# EAGLE design shieldrasp2 (EAGLE 9.5.1)
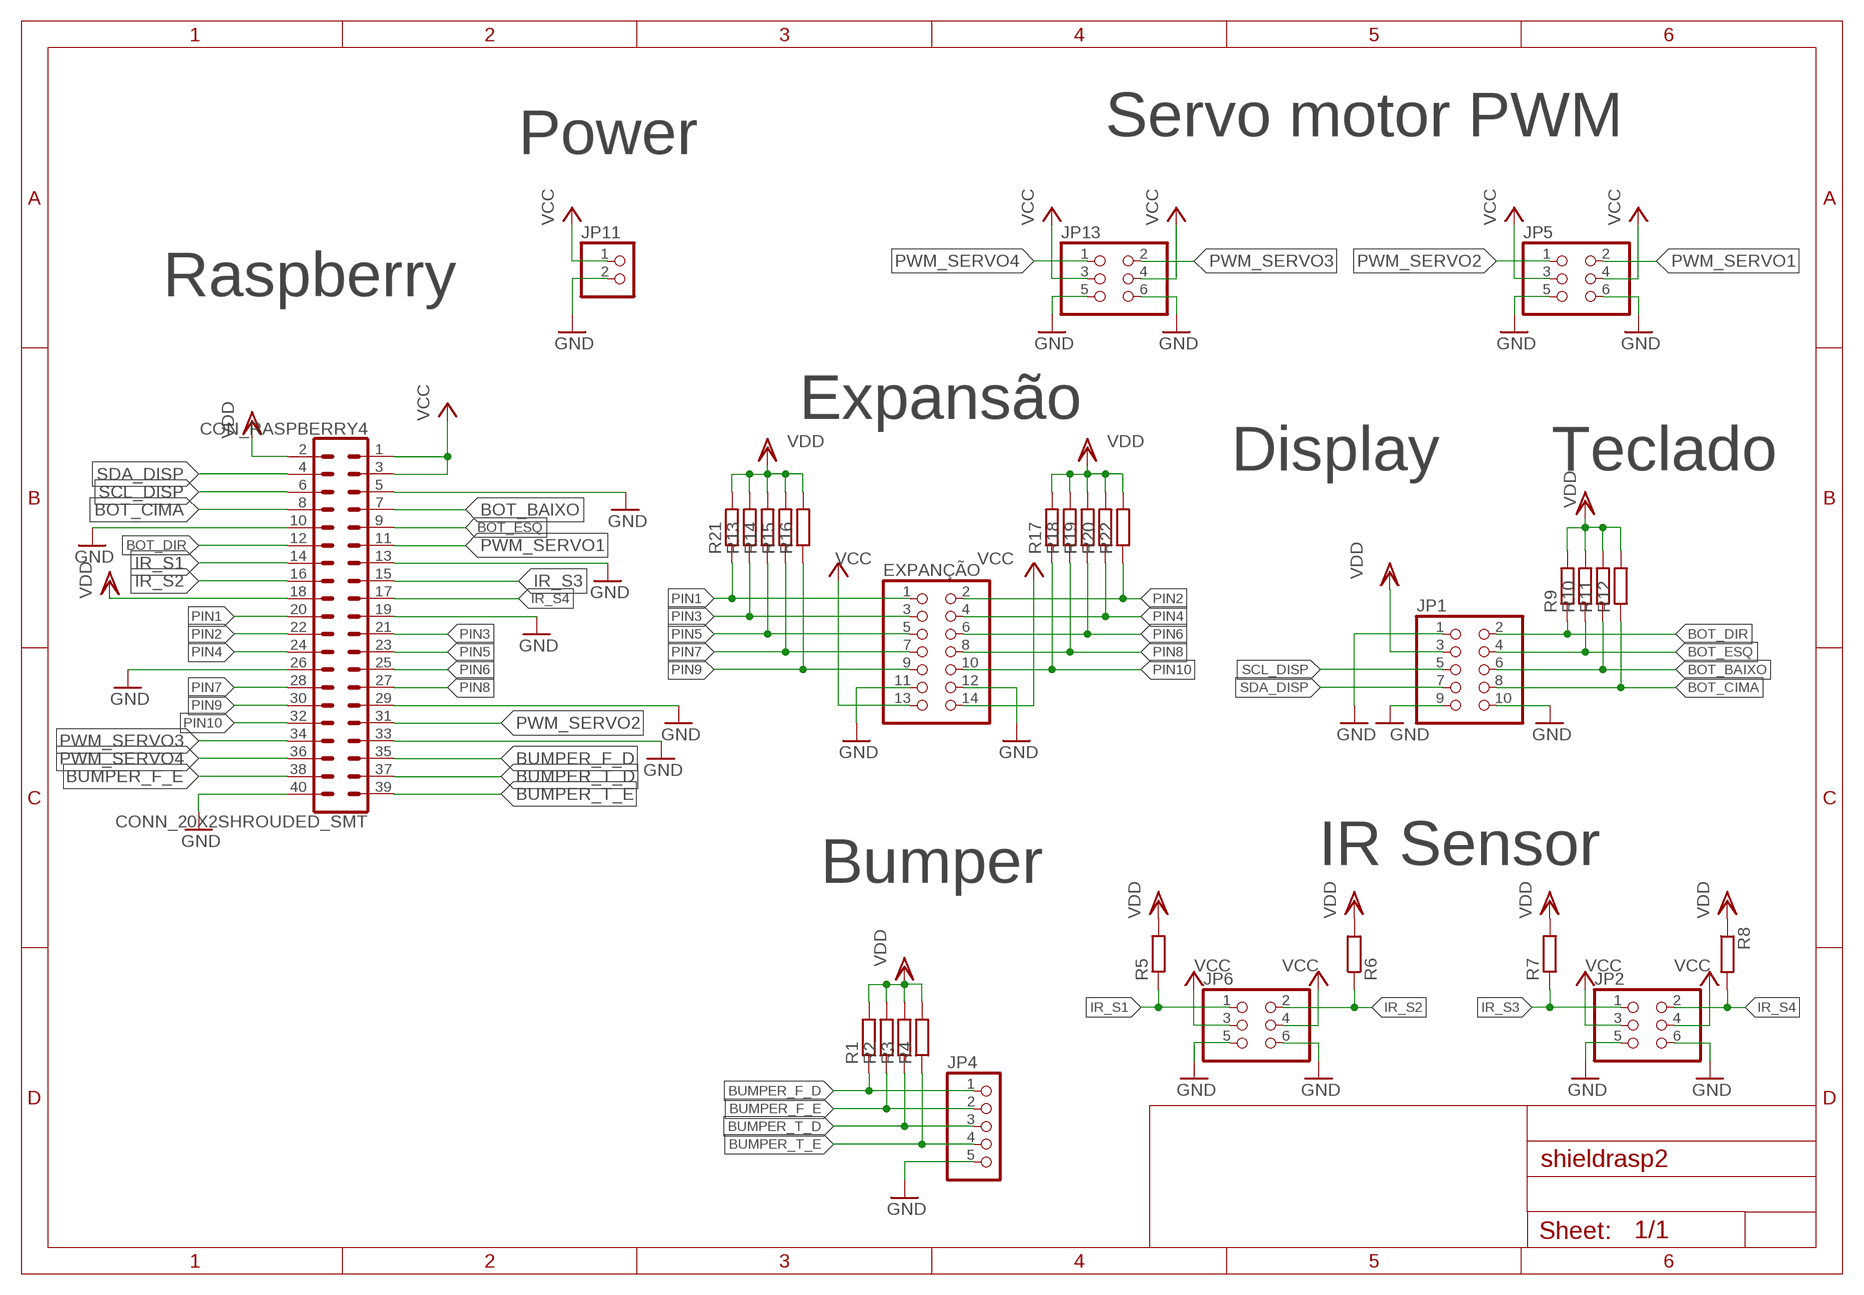
[diagram p0: schematic, sheet 1]

## Parts
CON_RASPBERRY4  CONN_20X2SHROUDED_SMT  [2X20_SHROUDED_SMT]
EXPANÇÃO  PINHD-2X7  [2X07]
JP1  PINHD-2X5/90  [2X05/90]
JP2  PINHD-2X3/90  [2X03/90]
JP4  PINHD-1X5/90  [1X05/90]
JP5  PINHD-2X3/90  [2X03/90]
JP6  PINHD-2X3/90  [2X03/90]
JP11  PINHD-1X2/90  [1X02/90]
JP13  PINHD-2X3/90  [2X03/90]
R1  R-EU_M0805  [M0805]
R2  R-EU_M0805  [M0805]
R3  R-EU_M0805  [M0805]
R4  R-EU_M0805  [M0805]
R5  R-EU_M0805  [M0805]
R6  R-EU_M0805  [M0805]
R7  R-EU_M0805  [M0805]
R8  R-EU_M0805  [M0805]
R9  R-EU_M0805  [M0805]
R10  R-EU_M0805  [M0805]
R11  R-EU_M0805  [M0805]
R12  R-EU_M0805  [M0805]
R13  R-EU_M0805  [M0805]
R14  R-EU_M0805  [M0805]
R15  R-EU_M0805  [M0805]
R16  R-EU_M0805  [M0805]
R17  R-EU_M0805  [M0805]
R18  R-EU_M0805  [M0805]
R19  R-EU_M0805  [M0805]
R20  R-EU_M0805  [M0805]
R21  R-EU_M0805  [M0805]
R22  R-EU_M0805  [M0805]

## Nets
BOT_BAIXO: CON_RASPBERRY4.7 JP1.6 R11.1
BOT_CIMA: CON_RASPBERRY4.8 JP1.8 R12.1
BOT_DIR: CON_RASPBERRY4.12 JP1.2 R9.1
BOT_ESQ: CON_RASPBERRY4.9 JP1.4 R10.1
BUMPER_F_D: CON_RASPBERRY4.35 JP4.1 R1.1
BUMPER_F_E: CON_RASPBERRY4.38 JP4.2 R2.1
BUMPER_T_D: CON_RASPBERRY4.37 JP4.3 R3.1
BUMPER_T_E: CON_RASPBERRY4.39 JP4.4 R4.1
GND: CON_RASPBERRY4.5 CON_RASPBERRY4.10 CON_RASPBERRY4.13 CON_RASPBERRY4.19 CON_RASPBERRY4.26 CON_RASPBERRY4.29 CON_RASPBERRY4.33 CON_RASPBERRY4.40 EXPANÇÃO.11 EXPANÇÃO.12 JP1.1 JP1.9 JP1.10 JP2.5 JP2.6 JP4.5 JP5.5 JP5.6 JP6.5 JP6.6 JP11.2 JP13.5 JP13.6
IR_S1: CON_RASPBERRY4.14 JP6.1 R5.1
IR_S2: CON_RASPBERRY4.16 JP6.2 R6.1
IR_S3: CON_RASPBERRY4.15 JP2.1 R7.1
IR_S4: CON_RASPBERRY4.17 JP2.2 R8.2
PIN1: CON_RASPBERRY4.20 EXPANÇÃO.1 R21.1
PIN2: CON_RASPBERRY4.22 EXPANÇÃO.2 R22.1
PIN3: CON_RASPBERRY4.21 EXPANÇÃO.3 R13.1
PIN4: CON_RASPBERRY4.24 EXPANÇÃO.4 R20.1
PIN5: CON_RASPBERRY4.23 EXPANÇÃO.5 R14.1
PIN6: CON_RASPBERRY4.25 EXPANÇÃO.6 R19.1
PIN7: CON_RASPBERRY4.28 EXPANÇÃO.7 R15.1
PIN8: CON_RASPBERRY4.27 EXPANÇÃO.8 R18.1
PIN9: CON_RASPBERRY4.30 EXPANÇÃO.9 R16.1
PIN10: CON_RASPBERRY4.32 EXPANÇÃO.10 R17.1
PWM_SERVO1: CON_RASPBERRY4.11 JP5.2
PWM_SERVO2: CON_RASPBERRY4.31 JP5.1
PWM_SERVO3: CON_RASPBERRY4.34 JP13.2
PWM_SERVO4: CON_RASPBERRY4.36 JP13.1
SCL_DISP: CON_RASPBERRY4.6 JP1.5
SDA_DISP: CON_RASPBERRY4.4 JP1.7
VCC: CON_RASPBERRY4.1 CON_RASPBERRY4.3 EXPANÇÃO.13 EXPANÇÃO.14 JP2.3 JP2.4 JP5.3 JP5.4 JP6.3 JP6.4 JP11.1 JP13.3 JP13.4
VDD [vcc]: CON_RASPBERRY4.2 CON_RASPBERRY4.18 JP1.3 R1.2 R2.2 R3.2 R4.2 R5.2 R6.2 R7.2 R8.1 R9.2 R10.2 R11.2 R12.2 R13.2 R14.2 R15.2 R16.2 R17.2 R18.2 R19.2 R20.2 R21.2 R22.2

## Notes on the sheet
- Power | Servo motor PWM
- Raspberry
- Expansão
- Display | Teclado
- Bumper | IR Sensor

## Library data of the parts
CON_RASPBERRY4 = SparkFun-Connectors:CONN_20X2: Multi connection point. Often used as Generic Header-pin footprint for 0.1 inch spaced/style header connections On any of the 0.1 inch spaced packages, you can populate with these: Break Away Headers - Straight <https://www.sparkfun.com/products/116> (PRT-00116) Break Away Male Headers - Right Angle <https://www.sparkfun.com/products/553> (PRT-00553) Female Headers <https://www.sparkfun.com/products/115> (PRT-00115) Break Away Headers - Machine Pin <https://www.sparkfun.com/products/117> (PRT-00117) Break Away Female Headers - Swiss Machine Pin <https://www.sparkfun.com/products/743> (PRT-00743); PROD_ID: CONN-13143
EXPANÇÃO = pinhead:PINHD-2X7: PIN HEADER
JP1 = pinhead:PINHD-2X5: PIN HEADER
JP2 JP5 JP6 JP13 = pinhead:PINHD-2X3: PIN HEADER
JP4 = pinhead:PINHD-1X5: PIN HEADER
JP11 = pinhead:PINHD-1X2: PIN HEADER
R1-R22 = rcl:R-EU_: RESISTOR, European symbol; SPICEPREFIX: R

## Net classes
1 vcc: width 0.508 mm

## Board
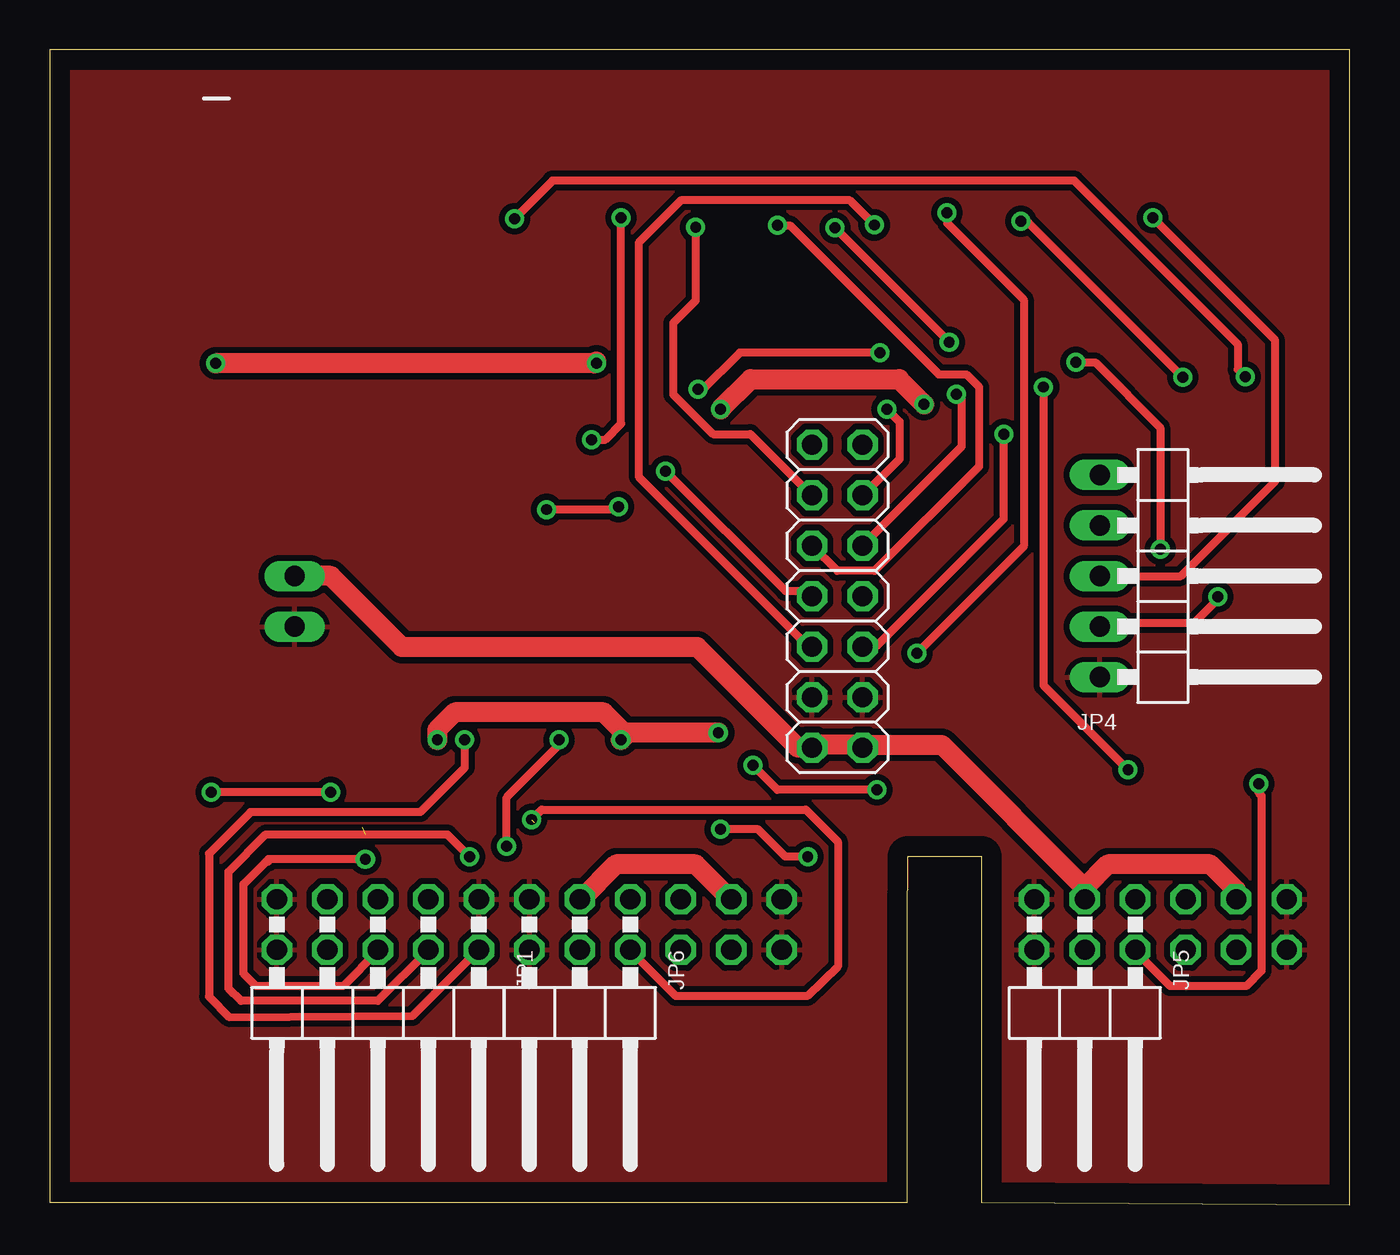
[diagram p1: board, top side]
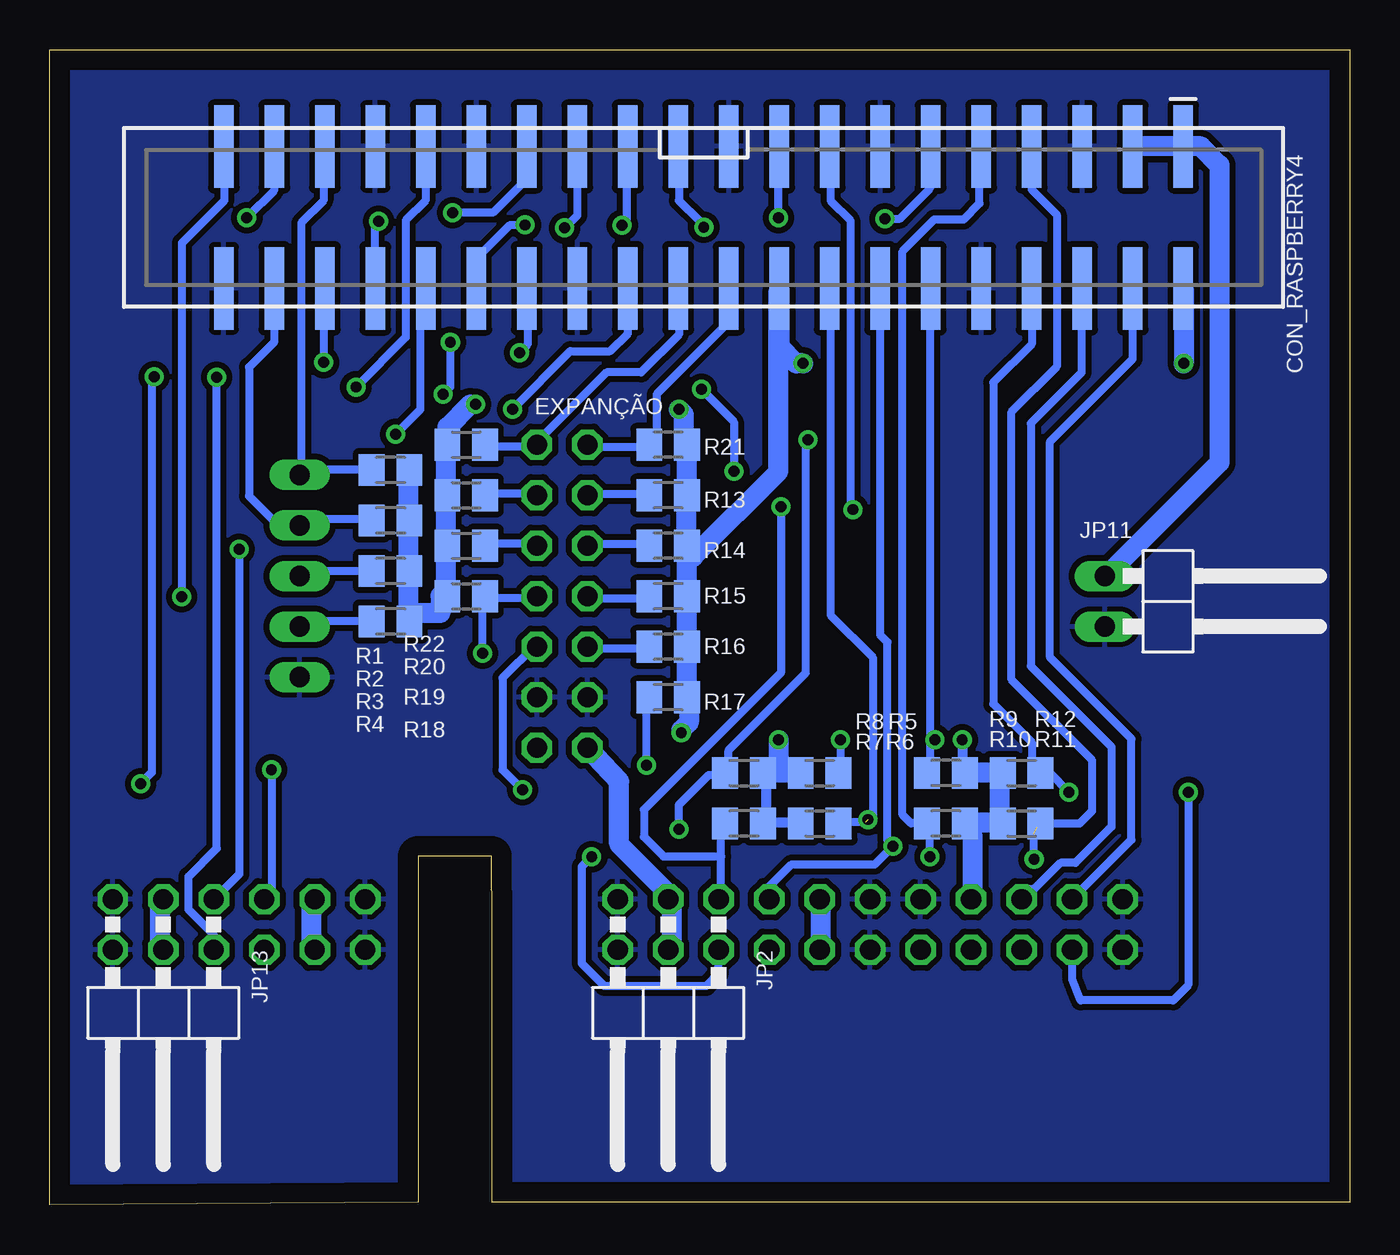
[diagram p2: board, bottom side, seen from below]

Size 65.41 x 58.09 mm. Coordinates in mm from the lower left corner, seen from the top.
Outline: 0,0.13 43.16,0.13 43.16,14.08 43.18,17.53 46.86,17.53 46.86,0.13 65.41,0 65.41,58.09 0,58.09 0,0.13
Copper layers (1*16): Top 0.035mm / dielectric 1.5mm / Bottom 0.035mm
Design rules "default *": minimum track width 16mil, minimum drill 0.35mm, track to track 12mil, track to pad 12mil, pad to pad 12mil, via to via 12mil, smd to smd 12mil, copper to edge 40mil, drill to drill 6mil, minimum pad ring 10mil, minimum via ring 8mil, stop-mask expansion 4mil, vias tented up to drill 0mil, thermal gap 10mil

### Footprints (pad centres in the part's own frame; a part is rotated, then mirrored left to right if it is on the bottom)
2X20_SHROUDED_SMT = smd 4.14 x 0.991: 1 -3.569,24.13; 2 3.569,24.13; 3 -3.569,21.59; 4 3.569,21.59; 5 -3.569,19.05; 6 3.569,19.05; 7 -3.569,16.51; 8 3.569,16.51; 9 -3.569,13.97; 10 3.569,13.97; 11 -3.569,11.43; 12 3.569,11.43; 13 -3.569,8.89; 14 3.569,8.89; 15 -3.569,6.35; 16 3.569,6.35; 17 -3.569,3.81; 18 3.569,3.81; 19 -3.569,1.27; 20 3.569,1.27; 21 -3.569,-1.27; 22 3.569,-1.27; 23 -3.569,-3.81; 24 3.569,-3.81; 25 -3.569,-6.35; 26 3.569,-6.35; 27 -3.569,-8.89; 28 3.569,-8.89; 29 -3.569,-11.43; 30 3.569,-11.43; 31 -3.569,-13.97; 32 3.569,-13.97; 33 -3.569,-16.51; 34 3.569,-16.51; 35 -3.569,-19.05; 36 3.569,-19.05; 37 -3.569,-21.59; 38 3.569,-21.59; 39 -3.569,-24.13; 40 3.569,-24.13
2X07 = drill 1.016 octagon: 1 -7.62,-1.27; 2 -7.62,1.27; 3 -5.08,-1.27; 4 -5.08,1.27; 5 -2.54,-1.27; 6 -2.54,1.27; 7 0,-1.27; 8 0,1.27; 9 2.54,-1.27; 10 2.54,1.27; 11 5.08,-1.27; 12 5.08,1.27; 13 7.62,-1.27; 14 7.62,1.27
2X05/90 = drill 1.016 octagon: 1 -5.08,-6.35; 2 -5.08,-3.81; 3 -2.54,-6.35; 4 -2.54,-3.81; 5 0,-6.35; 6 0,-3.81; 7 2.54,-6.35; 8 2.54,-3.81; 9 5.08,-6.35; 10 5.08,-3.81
2X03/90 = drill 1.016 octagon: 1 -2.54,-6.35; 2 -2.54,-3.81; 3 0,-6.35; 4 0,-3.81; 5 2.54,-6.35; 6 2.54,-3.81
1X05/90 = drill 1.016 long: 1 -5.08,-3.81; 2 -2.54,-3.81; 3 0,-3.81; 4 2.54,-3.81; 5 5.08,-3.81
1X02/90 = drill 1.016 long: 1 -1.27,-3.81; 2 1.27,-3.81
M0805 = smd 1.3 x 1.6: 1 -0.95,0; 2 0.95,0

### Placement (x,y rotation side)
CON_RASPBERRY4  32.51,49.66 270 bottom
EXPANÇÃO  39.62,30.61 270 top
JP1  16.51,9.02 180 top
JP2  34.29,9.02 180 bottom
JP4  56.64,31.62 270 top
JP5  52.07,9.02 180 top
JP6  26.67,9.02 180 top
JP11  8.51,30.35 270 bottom
JP13  59.69,9.02 180 bottom
R1  48.26,36.96 0 bottom
R2  48.26,34.42 0 bottom
R3  48.26,31.88 0 bottom
R4  48.26,29.34 0 bottom
R5  26.67,21.72 180 bottom
R6  26.67,19.18 180 bottom
R7  30.48,19.18 0 bottom
R8  30.48,21.72 180 bottom
R9  20.32,21.72 0 bottom
R10  20.32,19.18 0 bottom
R11  16.51,19.18 180 bottom
R12  16.51,21.72 180 bottom
R13  34.29,35.69 0 bottom
R14  34.29,33.15 0 bottom
R15  34.29,30.61 0 bottom
R16  34.29,28.07 0 bottom
R17  34.29,25.53 0 bottom
R18  44.45,30.61 180 bottom
R19  44.45,33.15 180 bottom
R20  44.45,35.69 180 bottom
R21  34.29,38.23 0 bottom
R22  44.45,38.23 180 bottom

### Tracks (layer width: path | path; a pad name or v marks a point on that pad's centre or on a via)
BOT_BAIXO  (via drill 0.55)  (1 unrouted)
  Top 0.406: v15.88,17.37 v15.87,17.38 11,17.38 11,17.25 10.88,17.25 9.75,16.13 9.75,11.63 10.38,11 14.75,11 16.5,12.75 JP1.6
  Bottom 0.406: 16,53.25 CON_RASPBERRY4.7 16,51.05 14.74,49.8 14.74,42.15 17.02,39.88 17.02,26.42 12.95,22.35 12.95,19.81 13.59,19.18 R11.1 15.75,18.98 | v15.88,17.37 15.88,18.64
BOT_CIMA  (via drill 0.55)
  Top 0.406: v14.12,20.75 v8.12,20.75
  Bottom 0.406: CON_RASPBERRY4.8 16,46 16,43.29 17.93,41.36 17.93,25.19 16,23.26 16,22.13 15.62,21.75 R12.1 15.38,21.75 15.12,21.75 v14.12,20.75 | JP1.8 13.97,11.38 13.55,10.29 8.89,10.29 8.12,11.05 v8.12,20.75
BOT_DIR  (via drill 0.55)
  Top 0.406: v20.88,23.38 20.88,21.98 18.64,19.75 10.1,19.75 8.01,17.66 8.02,10.47 9.04,9.45 18.25,9.5 21.5,12.75 JP1.2
  Bottom 0.406: 21.12,23.38 21.12,46 CON_RASPBERRY4.12 | 21.12,23.38 21.12,21.88 21.25,21.75 R9.1 | v20.88,23.38 21.12,23.38
BOT_ESQ  (via drill 0.55)
  Top 0.406: v21.12,17.5 20,18.63 10.88,18.63 9,16.75 9,10.88 9.62,10.25 16.5,10.25 19,12.75 JP1.4
  Bottom 0.406: v21.12,17.5 21.12,19 21.25,19.13 R10.1 22.07,19.18 22.5,19.61 22.5,47.95 20.9,49.55 19.43,49.55 18.62,50.36 18.62,53.13 CON_RASPBERRY4.9
BUMPER_F_D
  Bottom 0.406: R1.1 49.25,37 52.75,37 52.75,36.75 JP4.1 52.75,37.13 52.75,49.38 51.62,50.5 51.62,53.13 CON_RASPBERRY4.35
BUMPER_F_E
  Bottom 0.406: R2.1 49.25,34.5 52.75,34.5 52.75,34.25 JP4.2 52.84,34.25 53.98,34.25 55.38,35.64 55.38,42.13 54.12,43.38 54.12,46 CON_RASPBERRY4.38
BUMPER_T_D  (via drill 0.55)
  Top 0.406: v55.49,49.64 61.65,43.47 61.65,36.38 56.9,31.62 JP4.3
  Bottom 0.406: R3.1 52.75,31.88 52.75,31.63 JP4.3 | v55.49,49.64 54.12,51 54.12,53.13 CON_RASPBERRY4.37
BUMPER_T_E  (via drill 0.55)
  Top 0.406: v58.76,30.58 58.76,30.45 57.55,29.25 52.99,29.25 52.88,29.13 JP4.4
  Bottom 0.406: R4.1 49.25,29.38 52.75,29.38 52.75,29.13 JP4.4 | v58.76,30.58 58.76,48.37 56.62,50.5 56.62,53.13 CON_RASPBERRY4.39
GND
  pour Bottom: 0,0.13 0,58.55 66.04,58.55 66.04,0.13
  pour Top: 0,0.13 0,58.55 66.04,58.55 66.04,0.13
IR_S1  (via drill 0.55)
  Top 0.406: v25.62,23.38 25.62,23.12 22.99,20.49 v22.99,18.03
  Bottom 0.406: v25.62,23.38 25.62,21.75 R5.1 | CON_RASPBERRY4.14 23.63,28.67 23.25,28.29 23.25,18.3 v22.99,18.03 23.89,17.13 28.09,17.13 29.21,16 JP6.1
IR_S2  (via drill 0.55)  (1 unrouted)
  Top 0.406: v24.25,19.38 24.75,19.88 38.03,19.88 39.65,18.26 39.65,11.98 38.12,10.49 31.51,10.49 29.25,12.75 JP6.2
  Bottom 0.406: 24.38,19.25 25.62,19.25 R6.1 | CON_RASPBERRY4.16 26.12,46 26.12,29.66 24,27.54 24,19.38 24.12,19.25 v24.25,19.38
IR_S3  (via drill 0.55)
  Top 0.406: v28.62,35.11 28.48,34.97 v25,34.97
  Bottom 0.406: 31.62,17.53 31.62,15.5 JP2.1 | 31.62,17.53 31.62,19 31.5,19.13 R7.1 | v25,34.97 25.12,34.97 25.12,49.5 26.12,50.5 26.12,53.13 CON_RASPBERRY4.15 | v28.62,35.11 28.62,26.76 35.51,19.87 35.51,18.51 34.53,17.53 31.62,17.53
IR_S4  (via drill 0.55)
  Top 0.406: v33.74,18.88 35.64,18.88 37.01,17.51 v38.13,17.51 | v28.75,49.64 28.75,39.28 27.95,38.48 v27.26,38.48
  Bottom 0.406: v33.74,18.88 33.74,20.15 33.73,20.14 32.24,21.63 31.5,21.63 R8.2 31.25,21.75 31.25,22.87 27.37,26.75 27.37,38.37 v27.26,38.48 | v38.13,17.51 38.62,17.02 38.62,12.13 37.5,11 32.38,11 31.75,11.63 JP2.2 | v28.75,49.64 28.75,53.13 CON_RASPBERRY4.17
PIN1
  Bottom 0.406: EXPANÇÃO.1 38.25,38.13 35.25,38.13 R21.1 35.12,38.38 34.88,38.63 34.88,40.76 31.38,44.26 31.38,44.63 CON_RASPBERRY4.20
PIN2
  Bottom 0.406: R22.1 43.5,38.13 41,38.13 EXPANÇÃO.2 40.88,38.38 37.39,41.86 35.65,41.86 33.75,43.76 33.75,46 CON_RASPBERRY4.22
PIN3  (via drill 0.55)
  Top 0.406: v32.5,49.16 32.5,45.47 31.36,44.34 31.36,40.76 33.38,38.75 35.25,38.75 38.25,35.75 EXPANÇÃO.3
  Bottom 0.406: R13.1 35.25,35.75 38.25,35.75 EXPANÇÃO.3 | v32.5,49.16 32.75,49.16 32.75,49.5 33.75,50.5 33.75,53.13 CON_RASPBERRY4.21
PIN4  (via drill 0.55)
  Top 0.406: v42.12,40.02 42.75,39.39 42.75,37.5 41,35.75 EXPANÇÃO.4
  Bottom 0.406: R20.1 43.5,35.75 41,35.75 EXPANÇÃO.4 | CON_RASPBERRY4.24 36.32,43.82 37.21,42.93 39.22,42.93 v42.12,40.02
PIN5  (via drill 0.55)
  Top 0.406: EXPANÇÃO.5 38.38,33.13 39.62,31.88 41.5,31.88 46.75,37.13 46.75,41.14 46.12,41.77 44.72,41.77 37.24,49.25 v36.6,49.25
  Bottom 0.406: R14.1 35.25,33.25 38.25,33.25 EXPANÇÃO.5 | v36.6,49.25 36.38,49.48 36.38,53.13 CON_RASPBERRY4.23
PIN6  (via drill 0.55)
  Top 0.406: v45.62,40.76 45.88,40.76 45.88,38.13 41,33.25 EXPANÇÃO.6 | v39.5,49.13 v45.25,43.38
  Bottom 0.406: R19.1 43.5,33.25 41,33.25 EXPANÇÃO.6 | v45.62,40.76 45.25,41.13 v45.25,43.38 | v39.5,49.13 38.88,49.75 38.88,53.13 CON_RASPBERRY4.25
PIN7  (via drill 0.55)
  Top 0.406: v30.99,36.89 37,30.88 38,30.88 38.25,30.63 EXPANÇÃO.7 | v32.62,41.01 32.75,40.88 34.72,42.85 v41.78,42.85
  Bottom 0.406: R15.1 35.25,30.5 38.25,30.5 EXPANÇÃO.7 | v30.99,36.89 30.99,39.38 v32.62,41.01 | v41.78,42.85 41.38,43.25 41.38,46 CON_RASPBERRY4.28
PIN8  (via drill 0.55)
  Top 0.406: v43.62,27.73 49,33.11 49,45.52 45.14,49.38 v45.14,49.89
  Bottom 0.406: EXPANÇÃO.8 41,30.5 43.5,30.5 R18.1 43.62,30.38 v43.62,27.73 | v45.14,49.89 43.11,49.89 41.5,51.5 41.5,53.13 CON_RASPBERRY4.27
PIN9  (via drill 0.55)
  Top 0.406: v41.48,49.28 40.25,50.51 31.76,50.51 29.62,48.38 29.62,36.63 37.95,28.3 EXPANÇÃO.9
  Bottom 0.406: R16.1 35.25,28 38.25,28 EXPANÇÃO.9 | v41.48,49.28 42.24,49.28 43.88,47.64 43.88,46.13 CON_RASPBERRY4.30
PIN10  (via drill 0.55)
  Top 0.406: v35.38,22.11 36.61,20.87 v41.62,20.87 | v48,38.75 48,34.5 41.62,28.13 41,28.13 EXPANÇÃO.10
  Bottom 0.406: v35.38,22.11 35.38,25.38 35.25,25.5 R17.1 | v41.62,20.87 42.62,21.87 42.62,26.5 41,28.13 EXPANÇÃO.10 | v48,38.75 46.75,40 46.75,45.75 46.5,46 CON_RASPBERRY4.32
PWM_SERVO1  (via drill 0.55)
  Top 0.406: 60.95,21.06 v60.84,21.18 60.84,20.7 60.96,20.58 60.96,11.76 60.2,11 56.38,11 54.62,12.75 JP5.2 | v60.14,41.64 59.76,42.02 59.76,43.29 51.55,51.5 25.3,51.5 v23.39,49.6
  Bottom 0.406: v60.84,21.18 60.27,21.74 60.27,41.51 v60.14,41.64 | v23.39,49.6 22.63,49.6 21.12,51.1 21.12,53.13 CON_RASPBERRY4.11
PWM_SERVO2  (via drill 0.55)
  Top 0.406: v54.25,21.88 50,26.13 v50,41.13
  Bottom 0.406: v54.25,21.88 54.25,15.63 54.5,15.38 JP5.1 | v50,41.13 47.5,43.63 47.5,49.5 46.5,50.5 46.5,53.13 CON_RASPBERRY4.31
PWM_SERVO3  (via drill 0.55)
  Top 0.406: v57,41.63 49.17,49.46 v48.85,49.46
  Bottom 0.406: v57,41.63 57,17.92 58.42,16.5 58.42,14.84 57.15,13.57 JP13.2 | CON_RASPBERRY4.34 49.02,49.29 v48.85,49.46
PWM_SERVO4  (via drill 0.55)
  Top 0.406: v55.87,32.97 55.87,39.09 52.6,42.36 v51.62,42.36
  Bottom 0.406: v55.87,32.97 55.87,16.63 57.12,15.38 JP13.1 | v51.62,42.36 v51.62,42.37 51.62,46 CON_RASPBERRY4.36
SCL_DISP
  Bottom 0.406: JP1.5 16.51,15.87 15.89,15.87 14.56,17.2 13.8,17.2 11.99,19.01 11.99,23.03 16.05,27.09 16.05,39.3 13.5,41.85 13.5,46 CON_RASPBERRY4.6
SDA_DISP
  Bottom 0.406: JP1.7 10.98,18.35 10.98,23.43 15.09,27.53 15.09,38.38 10.92,42.55 CON_RASPBERRY4.4
VCC
  Top 0.406: 38.5,23.13 38.38,23 EXPANÇÃO.13 38.25,23 37.62,23 | 40.75,23.13 40.88,23 EXPANÇÃO.14 | 26.75,15.38 JP6.3 | 34.25,15.38 JP2.3 | 52.12,15.88 52.07,15.62 JP5.3
  Top 1.016: JP5.3 52.07,15.96 53.24,17.13 58.38,17.13 59.69,15.82 JP13.3 | 40.75,23.13 38.5,23.13 | 26.75,15.38 28.5,17.13 32.5,17.13 34.25,15.38 | 52.12,15.88 44.88,23.13 41,23.13 EXPANÇÃO.14 | JP11.1 14.13,31.63 17.72,28.05 32.58,28.05 37.62,23
  Bottom 0.406: CON_RASPBERRY4.3 CON_RASPBERRY4.1 | 12.25,31.63 JP11.1 | 52.25,13 52.12,12.88 | 52.25,15.13 52.12,15.25 JP5.3 | 59.88,13 59.75,12.88 | 59.88,15.13 59.75,15.25 JP13.3 | 26.63,15.26 JP6.3 | 34.12,13 34.25,12.88 | 34.12,15.13 34.25,15.25 JP2.3
  Bottom 1.016: 12.25,31.63 6.56,37.32 6.56,52.29 7.49,53.23 CON_RASPBERRY4.3 | 52.25,15.13 52.25,13 | 52.12,12.88 JP5.4 | 59.88,15.13 59.88,13 | 59.75,12.88 JP13.4 | 26.63,15.26 26.63,12.88 JP6.4 | 34.12,15.13 34.12,13 | 34.25,12.88 JP2.4 | JP2.3 34.29,15.68 36.76,18.14 36.76,21.3 EXPANÇÃO.13
VDD  (via drill 0.55)
  Top 0.508: v27.5,42.32 27.5,42.41 | 28.99,23.63 v28.74,23.38
  Top 1.016: 27.5,42.41 27.41,42.32 v8.36,42.32 | v33.63,23.75 29.11,23.75 v28.74,23.38 | v19.5,23.38 19.5,23.89 20.37,24.76 27.87,24.76 28.99,23.63 | v43.99,40.26 42.72,41.52 35.27,41.52 v33.75,40.01
  Bottom 0.508: CON_RASPBERRY4.2 8.36,46.06 | 47.38,29.38 R4.2 47.12,29.75 | 47.38,31.88 R3.2 47.38,32.13 | 47.38,34.5 R2.2 47.38,34.25 | 47.38,36.88 R1.2 | 45.5,30.63 R18.2 45.75,30.63 | 45.5,33.13 R19.2 45.5,33.38 | 45.5,35.75 R20.2 45.5,35.5 | 45.5,38.13 R22.2 45.4,39.12 | 17.5,19.25 R11.2 17.62,19.5 | 19.25,19.25 R10.2 | 17.5,21.75 R12.2 17.62,21.5 | 19.25,21.75 R9.2 19.25,22 19.5,22.25 v19.5,23.38 | R6.2 27.62,19.25 29.5,19.25 R7.2 29.38,19.5 29.38,21.5 R8.1 29.5,21.75 | 27.62,21.75 R5.2 | 33.38,35.75 R13.2 33.38,35.5 | 33.38,38.13 R21.2 33.5,38.38 | 33.38,25.63 R17.2 33.25,25.38 | 33.38,28 R16.2 33.38,28.25 | 33.38,30.63 R15.2 33.38,30.38 | 33.38,33.38 R14.2 33.03,32.59 | v43.99,40.26 44.26,40.26 | 28.75,45.89 CON_RASPBERRY4.18
  Bottom 1.016: 8.36,46.06 v8.36,42.32 | CON_RASPBERRY4.18 28.7,43.17 27.85,42.32 v27.5,42.32 | 47.38,31.88 47.38,29.38 | 47.38,36.88 47.38,34.5 | 47.38,34.25 47.38,32.13 | 45.5,33.13 45.5,30.63 | 45.5,38.13 45.5,35.75 | 45.5,35.5 45.5,33.38 | 47.12,29.75 45.75,29.75 45.75,30.63 | 19.25,19.25 17.5,19.25 | 19.25,21.75 17.5,21.75 | 17.62,21.5 17.62,19.5 | JP1.3 19,15.42 19,18.63 R10.2 | 29.5,21.75 27.62,21.75 | 33.38,38.13 33.38,35.75 | 33.38,28 33.38,25.63 | 33.38,30.63 33.38,33.13 R14.2 | 33.38,30.38 33.38,28.25 | 33.38,33.38 33.38,35.5 | R8.1 29.28,21.72 28.74,22.26 v28.74,23.38 | v33.63,23.75 33.63,23.88 33.25,24.26 33.25,25.38 | 45.4,39.12 44.26,40.26 | v33.75,40.01 33.5,39.76 33.5,38.38 | 28.75,45.89 28.75,36.88 33.03,32.59